# EAGLE design MotherBoard.ver2 (EAGLE 9.6.2)
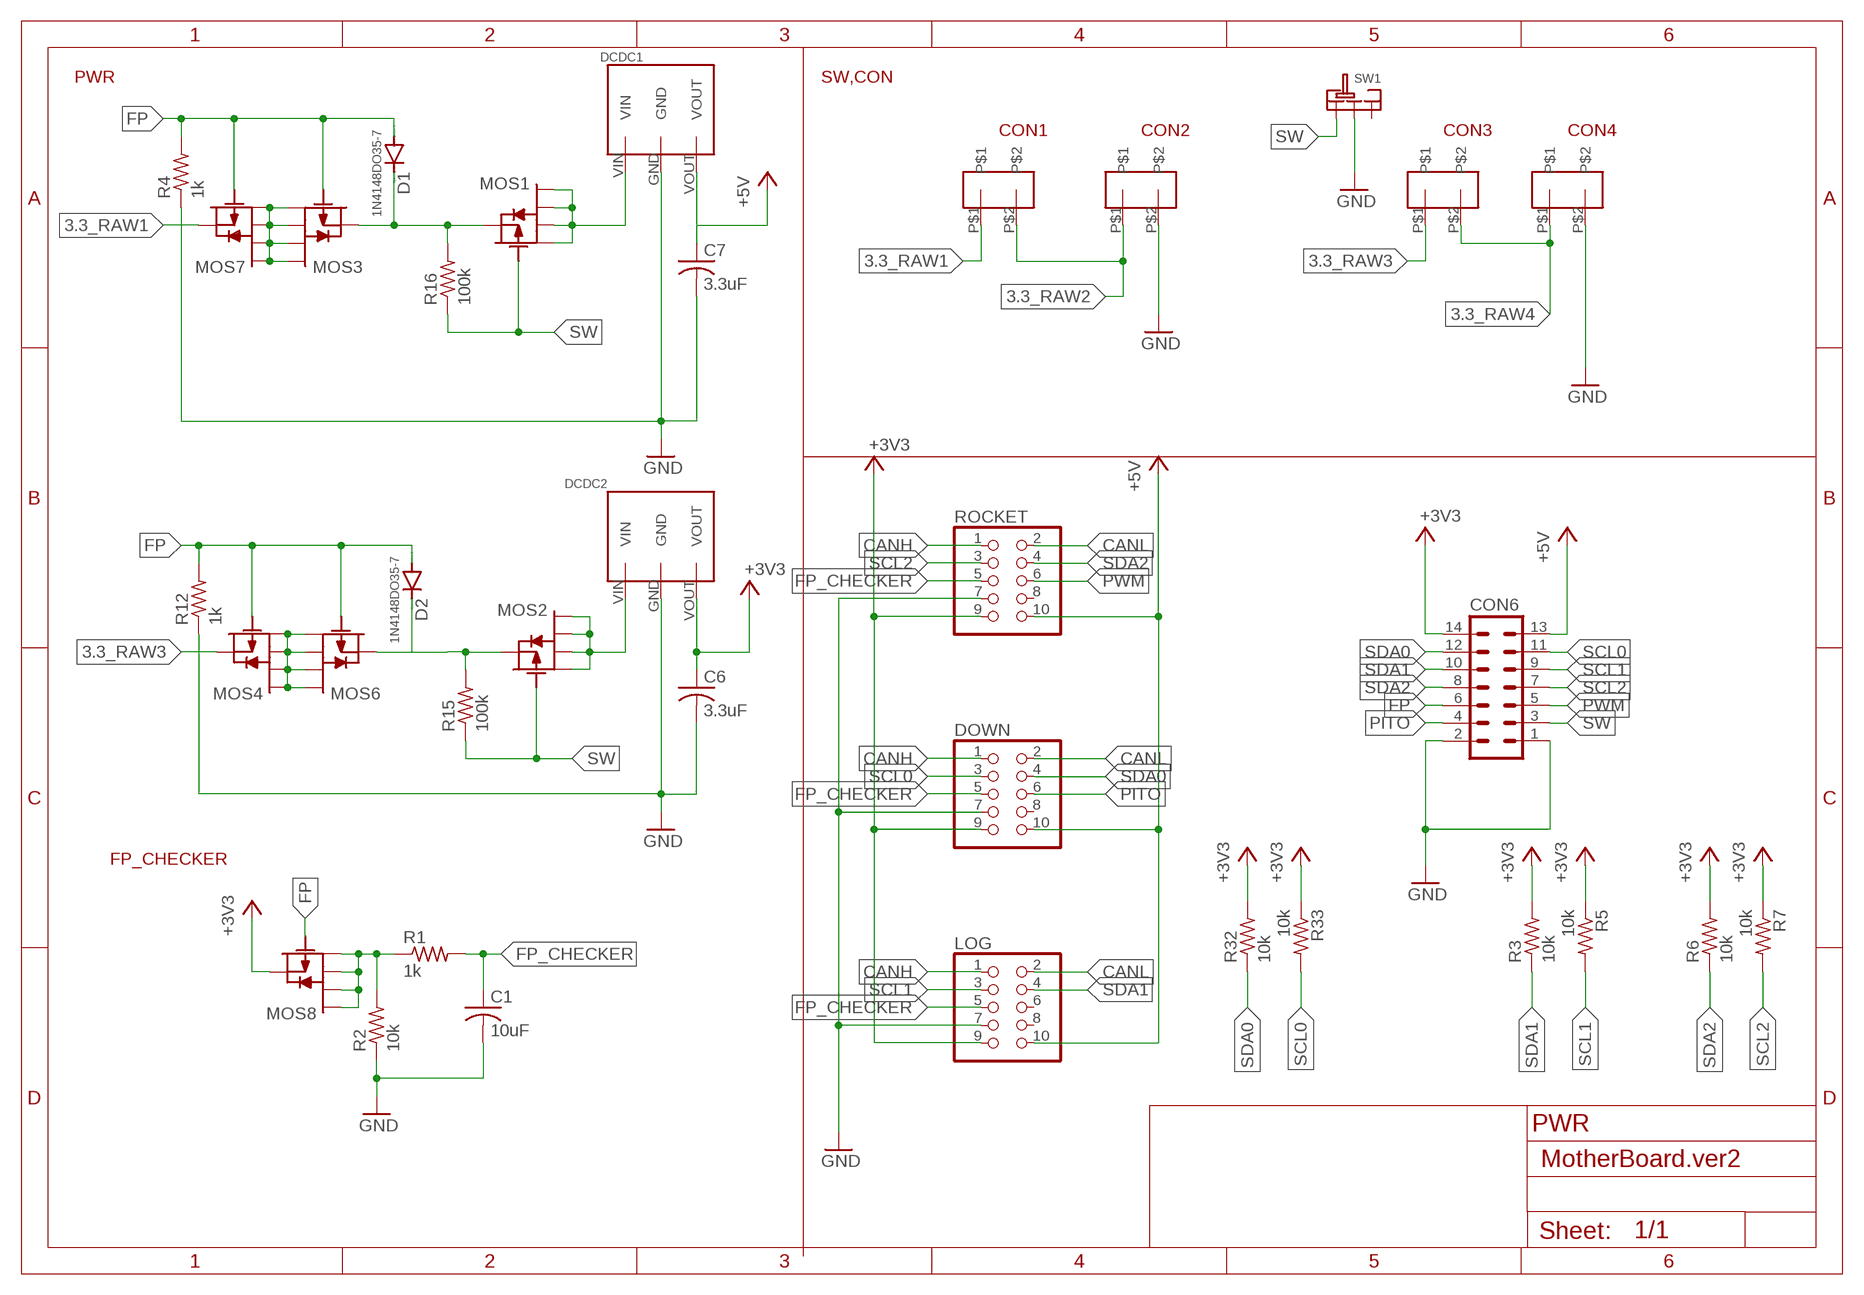
[diagram p0: schematic, sheet 1]

## Parts
C1  10uF  C-USC0603  [C0603]
C6  3.3uF  C-USC0603  [C0603]
C7  3.3uF  C-USC0603  [C0603]
CON1  1.25CON2PIN  [1.25CON2PIN]
CON2  1.25CON2PIN  [1.25CON2PIN]
CON3  1.25CON2PIN  [1.25CON2PIN]
CON4  1.25CON2PIN  [1.25CON2PIN]
CON6  ML14L  [ML14L]
D1  1N4148DO35-7  [DO35-7]
D2  1N4148DO35-7  [DO35-7]
DCDC1  5V1A_M78AR05-1  [5V1A_M78AR05-1]
DCDC2  3.3V1A_M78AR033-1  [3.3V1A_M78AR033-1]
DOWN  PINHD-2X5  [2X05]
LOG  PINHD-2X5  [2X05]
MOS1  PCH_SSM6J808R  [SSM6J808R]
MOS2  PCH_SSM6J808R  [SSM6J808R]
MOS3  PCH_SSM6J808R  [SSM6J808R]
MOS4  PCH_SSM6J808R  [SSM6J808R]
MOS6  PCH_SSM6J808R  [SSM6J808R]
MOS7  PCH_SSM6J808R  [SSM6J808R]
MOS8  PCH_SSM6J808R  [SSM6J808R]
R1  1k  R-US_R0603  [R0603]
R2  10k  R-US_R0603  [R0603]
R3  10k  R-US_R0603  [R0603]
R4  1k  R-US_R0603  [R0603]
R5  10k  R-US_R0603  [R0603]
R6  10k  R-US_R0603  [R0603]
R7  10k  R-US_R0603  [R0603]
R12  1k  R-US_R0603  [R0603]
R15  100k  R-US_R0603  [R0603]
R16  100k  R-US_R0603  [R0603]
R32  10k  R-US_R0603  [R0603]
R33  10k  R-US_R0603  [R0603]
ROCKET  PINHD-2X5  [2X05]
SW1  SRIDE_SWITCH  [SRIDE_SWITCH]

## Nets
3.3_RAW1: CON1.P$1 MOS7.4
3.3_RAW2: CON1.P$2 CON2.P$1
3.3_RAW3: CON3.P$1 MOS4.4
3.3_RAW4: CON3.P$2 CON4.P$1
+3V3: C6.1 CON6.14 DCDC2.VOUT DOWN.9 LOG.9 MOS8.4 R3.2 R5.1 R6.2 R7.1 R32.2 R33.1 ROCKET.9
+5V: C7.1 CON6.13 DCDC1.VOUT DOWN.10 LOG.10 ROCKET.10
+5V1: DCDC1.VIN MOS1.1 MOS1.2 MOS1.5 MOS1.6
CANH: DOWN.1 LOG.1 ROCKET.1
CANL: DOWN.2 LOG.2 ROCKET.2
FP: CON6.6 D1.A D2.A MOS3.3 MOS4.3 MOS6.3 MOS7.3 MOS8.3 R4.2 R12.2
FP_CHECKER: C1.1 DOWN.5 LOG.5 R1.2 ROCKET.5
GND [im]: C1.2 C6.2 C7.2 CON2.P$2 CON4.P$2 CON6.1 CON6.2 DCDC1.GND DCDC2.GND DOWN.7 LOG.7 R2.1 R4.1 R12.1 ROCKET.7 SW1.LR
N$1: MOS8.1 MOS8.2 MOS8.5 MOS8.6 R1.1 R2.2
N$3: D1.C MOS1.4 MOS3.4 R16.2
N$5: D2.C MOS2.4 MOS6.4 R15.2
N$6: MOS4.1 MOS4.2 MOS4.5 MOS4.6 MOS6.1 MOS6.2 MOS6.5 MOS6.6
N$8: DCDC2.VIN MOS2.1 MOS2.2 MOS2.5 MOS2.6
N$12: MOS3.1 MOS3.2 MOS3.5 MOS3.6 MOS7.1 MOS7.2 MOS7.5 MOS7.6
PITO: CON6.4 DOWN.6
PWM: CON6.5 ROCKET.6
SCL0: CON6.11 DOWN.3 R33.2
SCL1: CON6.9 LOG.3 R5.2
SCL2: CON6.7 R7.2 ROCKET.3
SDA0: CON6.12 DOWN.4 R32.1
SDA1: CON6.10 LOG.4 R3.1
SDA2: CON6.8 R6.1 ROCKET.4
SW: CON6.3 MOS1.3 MOS2.3 R15.1 R16.1 SW1.L
Unconnected: DOWN.8 LOG.6 LOG.8 ROCKET.8 SW1.R

## Notes on the sheet
- PWR | SW,CON
- FP_CHECKER
- PWR

## Library data of the parts
C1 C6 C7 = rcl:C-US: CAPACITOR, American symbol; SPICEPREFIX: C
CON1-CON4 = 1.25CON:1.25CON2PIN
CON6 = con-ml:ML14L
D1 D2 = diode:1N4148: DIODE high speed (Philips)
DCDC1 = DC-DC:5V1A_M78AR05-1
DCDC2 = DC-DC:3.3V1A_M78AR033-1
DOWN LOG ROCKET = pinhead:PINHD-2X5: PIN HEADER
MOS1-MOS4 MOS6-MOS8 = Chip MOSFET:PCH_SSM6J808R
R1-R7 R12 R15 R16 R32 R33 = rcl:R-US_: RESISTOR, American symbol; SPICEPREFIX: R
SW1 = Sride Switch:SRIDE_SWITCH

## Net classes
0 default: width 0.406 mm

## Board
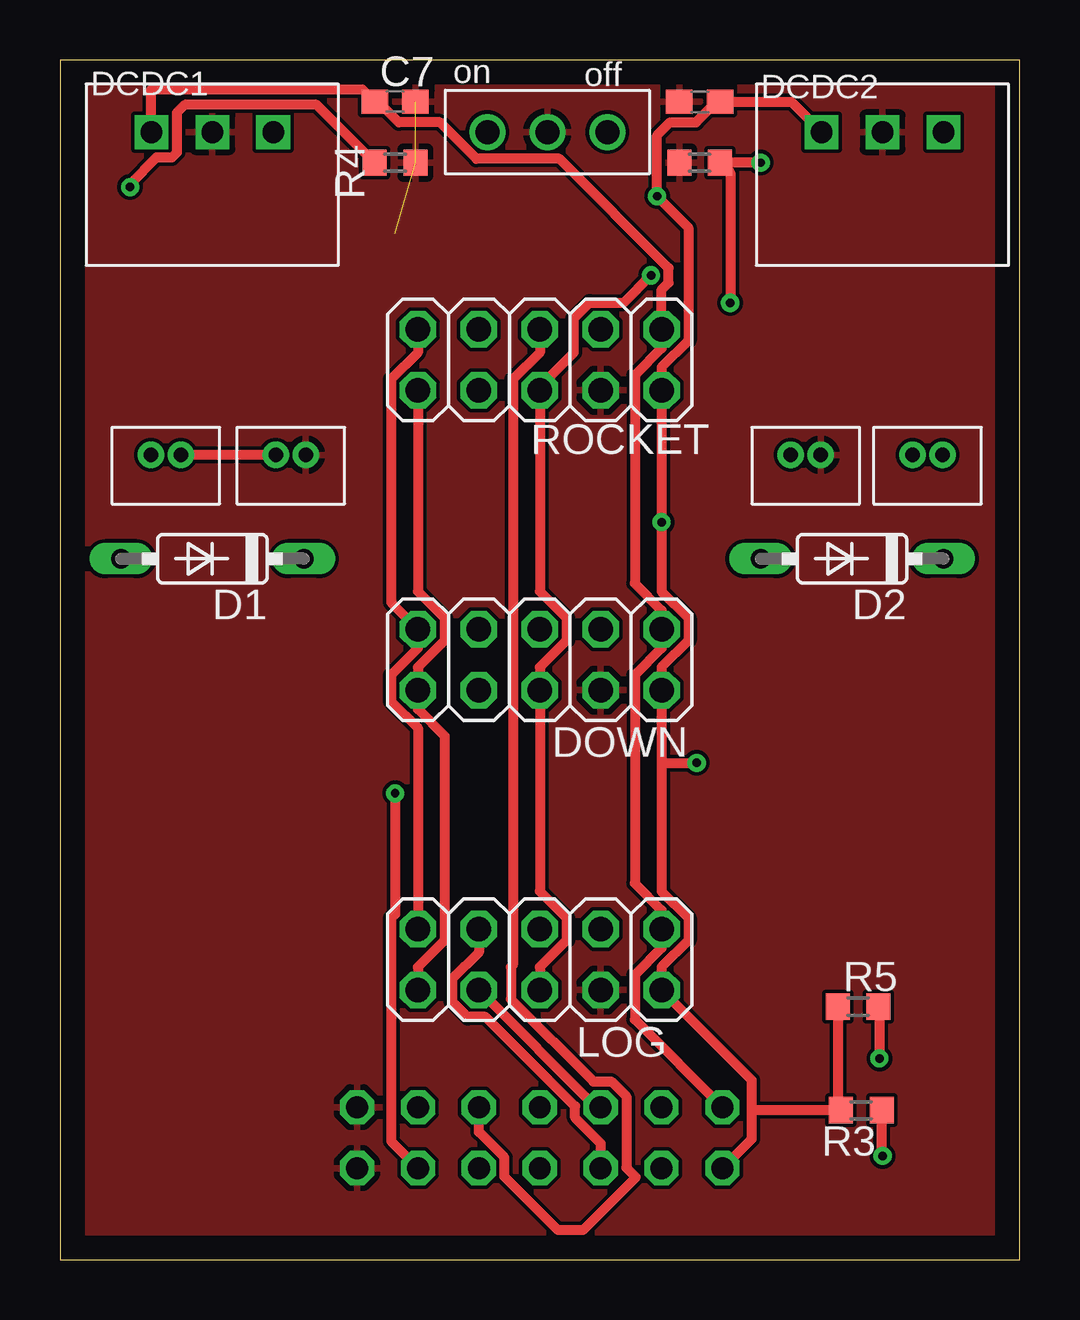
[diagram p1: board, top side]
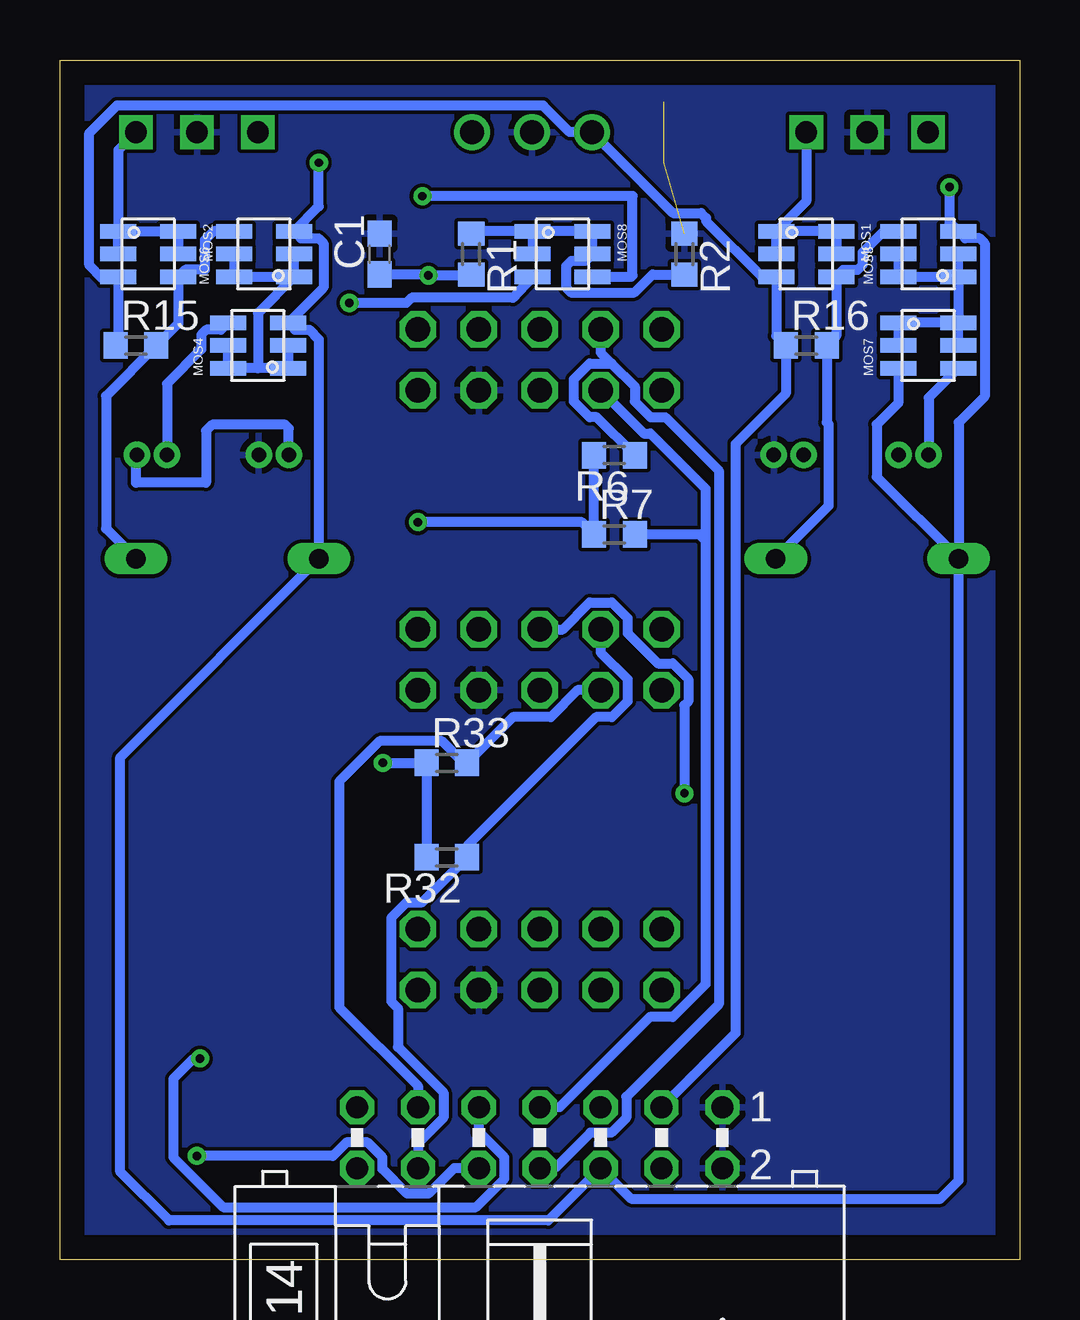
[diagram p2: board, bottom side, seen from below]

Size 40 x 50 mm. Coordinates in mm from the lower left corner, seen from the top.
Outline: 0,0 40,0 40,50 0,50 0,0
Copper layers (1*16): Top 0.035mm / dielectric 1.5mm / Bottom 0.035mm
Design rules "default": minimum track width 6mil, minimum drill 0.35mm, track to track 6mil, track to pad 6mil, pad to pad 6mil, via to via 6mil, smd to smd 6mil, copper to edge 40mil, drill to drill 6mil, minimum pad ring 10mil, minimum via ring 8mil, stop-mask expansion 4mil, vias tented up to drill 0mil, thermal gap 10mil

### Footprints (pad centres in the part's own frame; a part is rotated, then mirrored left to right if it is on the bottom)
C0603 = smd 1.1 x 1: 1 -0.85,0; 2 0.85,0
1.25CON2PIN = drill 0.6: P$1 1.25,-2.4; P$2 2.5,-2.4
ML14L = drill 0.914 octagon: 1 -7.62,-1.27; 2 -7.62,1.27; 3 -5.08,-1.27; 4 -5.08,1.27; 5 -2.54,-1.27; 6 -2.54,1.27; 7 0,-1.27; 8 0,1.27; 9 2.54,-1.27; 10 2.54,1.27; 11 5.08,-1.27; 12 5.08,1.27; 13 7.62,-1.27; 14 7.62,1.27
DO35-7 = drill 0.813 long: A 3.81,0; C -3.81,0
5V1A_M78AR05-1 = drill 0.9 pad 1.27 square: GND 0,0; VIN 2.54,0; VOUT -2.54,0
3.3V1A_M78AR033-1 = drill 0.9 pad 1.27 square: GND 0,0; VIN 2.54,0; VOUT -2.54,0
2X05 = drill 1.016 octagon: 1 -5.08,-1.27; 2 -5.08,1.27; 3 -2.54,-1.27; 4 -2.54,1.27; 5 0,-1.27; 6 0,1.27; 7 2.54,-1.27; 8 2.54,1.27; 9 5.08,-1.27; 10 5.08,1.27
SSM6J808R = smd 0.6 x 1.5: 1 -0.95,-1.25; 2 0,-1.25; 3 0.95,-1.25; 4 0.95,1.25; 5 0,1.25; 6 -0.95,1.25
R0603 = smd 1 x 1.1: 1 -0.85,0; 2 0.85,0
SRIDE_SWITCH = drill 1: L -2.5,0; LR 0,0; R 2.5,0

### Placement (x,y rotation side)
C1  26.67,41.91 90 bottom
C6  26.67,48.26 180 top
C7  13.97,48.26 0 top
CON1  2.54,35.94 0 top
CON2  7.75,35.94 0 top
CON3  34.29,35.94 0 top
CON4  29.21,35.94 0 top
CON6  20,5.08 180 bottom
D1  6.35,29.21 180 top
D2  33.02,29.21 180 top
DCDC1  6.35,46.99 0 top
DCDC2  34.29,46.99 0 top
DOWN  20,25 0 top
LOG  20,12.5 0 top
MOS1  8.89,41.91 270 bottom
MOS2  36.32,41.91 270 bottom
MOS3  3.81,41.91 90 bottom
MOS4  31.75,38.1 90 bottom
MOS6  31.5,41.91 90 bottom
MOS7  3.81,38.1 270 bottom
MOS8  19.05,41.91 270 bottom
R1  22.86,41.91 270 bottom
R2  13.97,41.91 270 bottom
R3  33.4,6.22 180 top
R4  13.97,45.72 180 top
R5  33.27,10.54 0 top
R6  16.89,33.53 180 bottom
R7  16.89,30.23 0 bottom
R12  26.67,45.72 0 top
R15  36.83,38.1 0 bottom
R16  8.89,38.1 0 bottom
R32  23.88,16.76 180 bottom
R33  23.88,20.7 0 bottom
ROCKET  20,37.5 0 top
SW1  20.32,46.99 0 top

### Tracks (layer width: path | path; a pad name or v marks a point on that pad's centre or on a via)
3.3_RAW1
  Bottom 0.406: MOS7.4 3.79,35.92 CON1.P$1
3.3_RAW2
  Top 0.406: CON2.P$1 CON1.P$2
3.3_RAW3
  Bottom 0.406: CON3.P$1 35.54,36.51 34.11,37.94 34.11,38.55 33.9,38.76 33.29,38.76 MOS4.4
3.3_RAW4
  Bottom 0.406: CON4.P$1 30.46,34.65 30.61,34.8 33.66,34.8 33.91,34.54 33.91,32.38 36.83,32.38 36.83,33.5 CON3.P$2
+3V3  (via drill 0.35)
  Top 0.406: DCDC2.VOUT 30.48,48.26 C6.1 27.37,48.26 26.52,47.4 25.43,47.4 24.89,46.86 v24.89,44.32 26.2,43.02 26.2,38.31 25.08,37.19 ROCKET.9 v25.08,30.73 25.08,27.85 26.2,26.73 26.2,25.81 25.08,24.69 DOWN.9 25.08,20.7 | 25.08,20.7 25.08,15.35 26.2,14.23 26.2,13.31 25.08,12.19 LOG.9 28.83,7.48 28.83,6.35 | CON6.14 28.83,5.02 28.83,6.35 | 25.08,20.7 v26.54,20.7 | R5.1 32.42,6.35 R3.2 28.96,6.22 28.83,6.35
  Bottom 0.406: MOS8.4 16.19,40.96 16.13,41.02 16.13,44.32 v24.89,44.32 | v26.54,20.7 R33.1 R32.2 | 25.15,30.73 v25.08,30.73 18.25,30.73 R7.1 R6.2
+5V
  Top 0.406: DCDC1.VOUT 3.81,48.77 12.61,48.77 C7.1 13.27,48.26 14.12,47.4 15.84,47.4 17.36,45.88 20.82,45.88 25.37,41.33 25.37,40.72 25.08,40.42 ROCKET.10 25.08,37.98 23.96,36.86 23.96,28.18 25.08,27.06 DOWN.10 25.08,25.48 23.96,24.36 23.96,15.68 25.08,14.56 LOG.10 25.08,12.98 23.96,11.86 23.96,10.01 CON6.13
+5V1
  Bottom 0.406: DCDC1.VIN 8.89,44.11 MOS1.1 | MOS1.1 MOS1.6 MOS1.5 | MOS1.2 MOS1.1
CANH
  Top 0.406: ROCKET.1 14.92,27.85 16.04,26.73 16.04,25.81 14.92,24.69 DOWN.1 14.92,22.94 16.04,21.82 16.04,13.31 14.92,12.19 LOG.1
CANL
  Top 0.406: ROCKET.2 14.92,37.81 13.8,36.69 13.8,27.39 DOWN.2 14.92,25.48 13.8,24.36 13.8,23.27 14.92,22.15 LOG.2
FP  (via drill 0.35)
  Top 0.406: v29.21,45.72 R12.2 27.94,45.3 v27.94,39.88 | R4.2 10.71,48.13 5.21,48.13 4.87,47.8 4.87,46.14 4.66,45.93 4.02,45.93 2.92,44.83 v2.92,44.7
  Bottom 0.406: v29.21,45.72 29.21,43.9 MOS6.3 29.95,42.57 29.22,42.57 29.01,42.36 29.01,40.51 30.48,39.05 MOS4.3 30.21,38.76 29.6,38.76 29.21,38.36 D2.A 37.49,20.93 37.49,3.66 35.46,1.63 19.64,1.63 CON6.6 16.19,2.54 3.3,2.54 2.54,3.3 D1.A | v27.94,39.88 25.55,39.88 25.34,40.09 21.12,40.09 MOS8.3 | MOS7.3 5.06,35.7 5.95,34.81 5.95,32.62 D1.A | D1.A 2.54,34.89 1.45,35.98 1.45,42.36 1.66,42.57 2.27,42.57 MOS3.3 2.92,43.22 v2.92,44.7
FP_CHECKER  (via drill 0.35)
  Top 0.406: v24.64,41.02 23.5,39.89 22.08,39.89 21.42,39.23 21.42,37.8 20,36.38 ROCKET.5 20,27.85 21.12,26.73 21.12,25.81 20,24.69 DOWN.5 20,15.35 21.12,14.23 21.12,13.31 20,12.19 LOG.5
  Bottom 0.406: R1.2 22.9,41.02 v24.64,41.02 24.68,41.06 C1.1
GND  (2 unrouted)
  pour Top: 0,52.07 41.91,52.07 44.45,49.53 44.45,-3.81 43.18,-5.08 -2.54,-5.08 -5.08,-2.54 -5.08,52.07
  pour Bottom: -5.08,52.07 44.45,52.07 45.72,50.8 45.72,-3.81 44.45,-5.08 -3.81,-5.08 -5.08,-3.81
N$1
  Bottom 0.406: MOS8.1 22.76,42.86 R1.1 | MOS8.1 MOS8.2 | MOS8.1 MOS8.6 MOS8.5 18.09,41.62 18.7,41.62 18.91,41.41 18.91,40.51 18.7,40.3 16.05,40.3 15.3,41.06 R2.2
N$3
  Bottom 0.406: MOS3.4 5.66,42.86 6.53,41.99 6.53,41.46 6.74,41.25 7.35,41.25 MOS1.4 7.64,38.5 R16.2 8.04,34.89 7.96,34.81 7.96,31.41 D1.C
N$5
  Bottom 0.406: MOS6.4 33.6,42.86 33.97,42.5 33.97,41.25 34.78,41.25 MOS2.4 35.07,39.01 R15.2 38.08,36 38.08,30.46 D2.C
N$6
  Bottom 0.406: MOS6.5 MOS6.6 MOS6.1 | MOS6.1 MOS6.2 | MOS4.2 MOS4.1 31.75,37.15 | 31.75,37.15 MOS4.6 MOS4.5 | MOS6.1 31.75,39.46 31.75,37.15
N$8
  Bottom 0.406: DCDC2.VIN 37.57,46.25 MOS2.1 | MOS2.1 MOS2.6 MOS2.5 | MOS2.2 MOS2.1
N$12
  Bottom 0.406: MOS3.5 MOS3.6 MOS3.1 | MOS3.1 MOS3.2 | MOS3.1 MOS7.6 | MOS7.6 MOS7.1 MOS7.2 | MOS7.5 MOS7.6
PITO  (via drill 0.35)
  Top 0.406: v13.97,19.43 13.97,14.4 13.8,14.23 13.8,4.93 CON6.4
  Bottom 0.406: DOWN.6 19.04,26.27 17.92,27.39 17,27.39 16.34,26.73 16.34,26.11 15.08,24.85 14.46,24.85 13.8,24.19 13.8,23.27 13.97,23.1 v13.97,19.43
PWM
  Top 0.406: ROCKET.6 20,37.81 18.88,36.69 18.88,12.28 18.8,12.19 18.8,10.85 22.23,7.42 22.98,7.42 23.61,6.79 23.61,3.83 24,3.43 21.79,1.22 20.77,1.22 18.53,3.46 18.53,4.25 17.46,5.32 CON6.5
SCL0
  Bottom 0.406: CON6.11 25.08,7.24 28.36,10.51 28.36,13.59 28.36,13.6 28.36,19.93 26.68,21.61 24.08,21.61 23.17,20.7 R33.2 21.11,22.61 19.54,22.61 18.42,23.73 DOWN.3
SCL1  (via drill 0.35)
  Top 0.406: LOG.3 22.34,6.35 CON6.9 | R5.2 34.16,10.5 v34.16,8.38
  Bottom 0.406: CON6.9 22.54,5.32 21.47,4.25 21.47,3.37 22.66,2.18 33.19,2.18 35.28,4.27 35.28,7.52 34.42,8.38 v34.16,8.38
SCL2
  Bottom 0.406: CON6.7 19.18,6.35 15.41,10.11 14.46,10.11 13.09,11.48 13.09,29.97 | 13.09,29.97 13.35,30.23 R7.2 | ROCKET.3 15.66,34.43 15.39,34.43 13.09,32.13 13.09,29.97
SDA0
  Bottom 0.406: DOWN.4 17.46,25.31 16.34,24.19 16.34,23.27 17,22.61 17.65,22.61 23.03,17.23 R32.1 24.9,14.89 25.54,14.89 26.2,14.23 26.2,10.77 25.91,10.48 25.91,8.86 24.01,6.96 24.01,5.91 25.08,4.84 CON6.12
SDA1  (via drill 0.35)
  Top 0.406: CON6.10 22.54,4.84 21.47,5.91 21.47,6.38 17.75,10.11 17,10.11 16.34,10.77 16.34,11.69 17.46,12.81 LOG.4 | v34.29,4.32 34.25,4.36 R3.1
  Bottom 0.406: CON6.10 23.57,3.81 24.64,2.74 25.52,2.74 26.55,3.77 26.55,4.25 27.18,4.88 28.06,4.88 28.62,4.32 v34.29,4.32
SDA2
  Bottom 0.406: ROCKET.4 17.46,37.81 17,37.35 | 17,37.35 16.04,36.39 16.04,35.77 15.38,35.11 14.76,35.11 12.53,32.88 12.53,10.64 16.39,6.78 16.39,5.91 17.02,5.28 17.89,5.28 19.36,3.81 CON6.8 | 17,37.35 17.01,37.35 17.92,37.35 18.58,36.69 18.58,35.77 17.92,35.11 17.62,35.11 R6.1
SW
  Bottom 0.406: R15.1 37.57,38.21 MOS2.3 37.66,40.87 38.22,40.87 38.78,41.44 38.78,46.95 37.63,48.1 19.86,48.1 18.75,46.99 SW1.L 14.45,43.62 13.27,43.62 13.06,43.41 13.06,43.28 10.74,40.96 MOS1.3 10.14,38.5 R16.1 9.74,36.1 11.84,34 11.84,9.43 CON6.3

### Text on the board
tPlace: on | off